# Altium schematic sheet Power_Delivery.SchDoc: FPGA Motherboard for Digital Multiplexed Readout, McGill U.
size Letter; DocumentNumber: DfMUX21; Revision: Rev0, Prototype; SheetNumber: 21; SheetTotal: 27; PageSetup: Record=PageOptions|CenterHorizontal=True|CenterVertical=True|PrintScale=0.93|XCorrection=1.00|YCorrection=1.00|PrintKind=0|BorderSize=5000000|LeftOffset=0|BottomOffset=0|Orientation=2|PaperLength=1000|PaperWidth=1000|Scale=100|PaperSource=7|PrintQuality=-4|MediaType=1|DitherType=10|PaperKind=Letter|PrintScaleMode=1
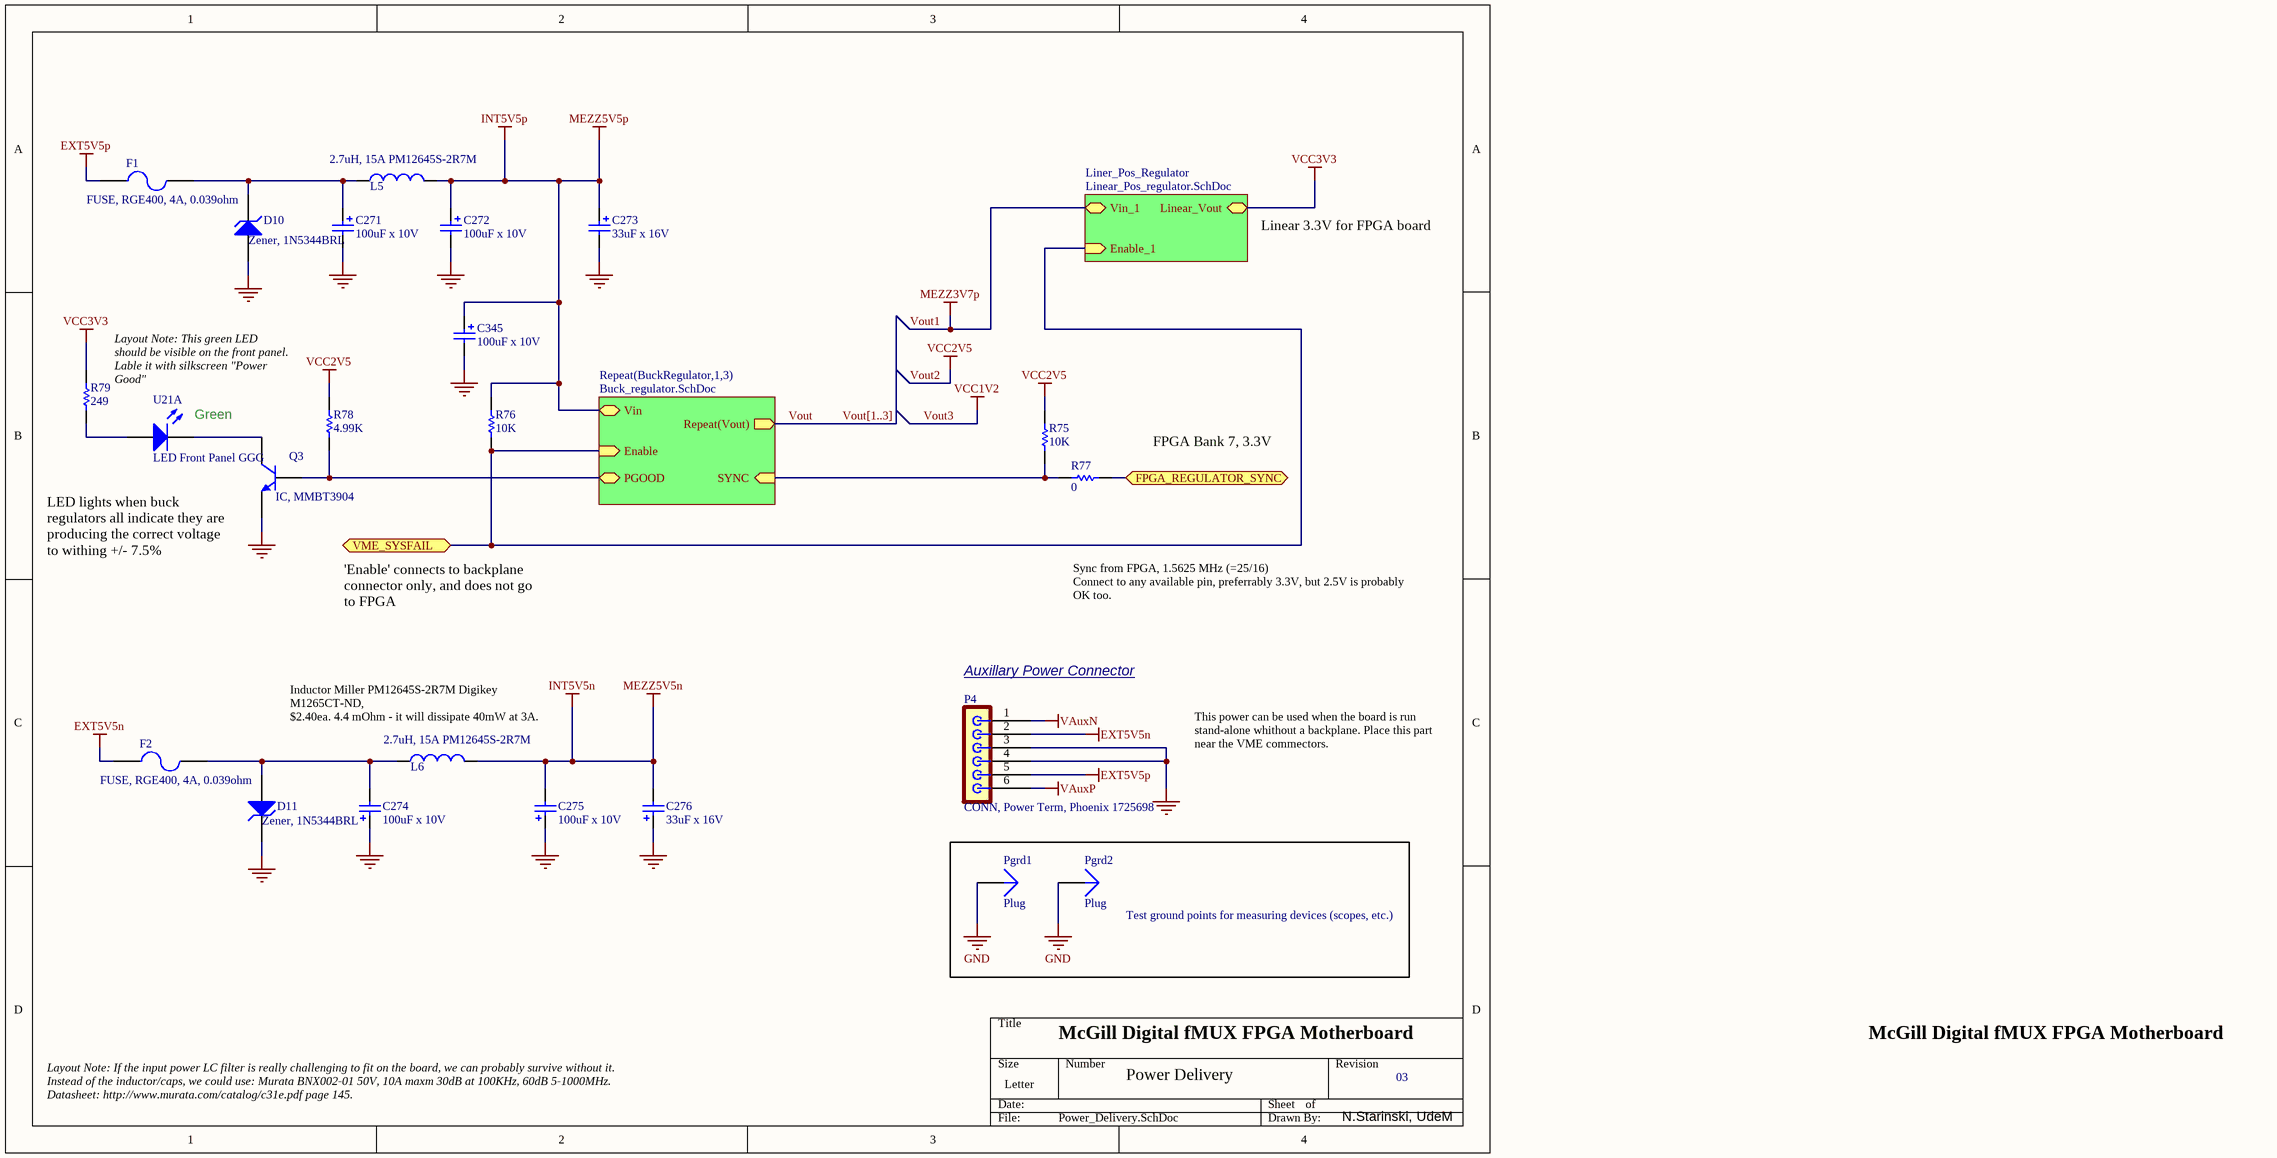
[diagram p0: Power_Delivery.SchDoc]

## Parts
C271  100uF x 10V  [TC6032-2412]
C272  100uF x 10V  [TC6032-2412]
C273  33uF x 16V  [CC4532-1812]
C274  100uF x 10V  [TC6032-2412]
C275  100uF x 10V  [TC6032-2412]
C276  33uF x 16V  [CC4532-1812]
C345  100uF x 10V  [TC6032-2412]
D10  Zener, 1N5344BRL  [DIODE-0.7]
D11  Zener, 1N5344BRL  [DIODE-0.7]
F1  FUSE, RGE400, 4A, 0.039ohm  [Fuse 5.88mm]
F2  FUSE, RGE400, 4A, 0.039ohm  [Fuse 5.88mm]
L5  2.7uH, 15A PM12645S-2R7M  [MLC_inductor]
L6  2.7uH, 15A PM12645S-2R7M  [MLC_inductor]
P4  CONN, Power Term, Phoenix 1725698  [TrmBlk6]
Pgrd1  Plug  [PIN1]
Pgrd2  Plug  [PIN1]
Q3  IC, MMBT3904  [SOT23]
R75  10K  [CR1608-0603]
R76  10K  [CR1608-0603]
R77  0  [CR1608-0603]
R78  4.99K  [CR1608-0603]
R79  249  [CR1608-0603]
U21  LED Front Panel GGG  [LED_Tri_]  (part A of 3)

## Blocks framed on the sheet
Test ground points for measuring devices (scopes, etc.): Pgrd1 Pgrd2

## Sub-sheets
Liner_Pos_Regulator = Linear_Pos_regulator.SchDoc: Vin_1, Enable_1 (in), Linear_Vout
Repeat(BuckRegulator,1,3) = Buck_regulator.SchDoc: Vin, Enable (in), PGOOD (bidir), Repeat(Vout) (out), SYNC (in)

## Ports
FPGA_REGULATOR_SYNC (bidir), VME_SYSFAIL (bidir)

## Nets
EXT5V5n: F2.1 P4.2
EXT5V5p: F1.1 P4.5
GND: C271.2 C272.2 C273.2 C274.1 C275.1 C276.1 C345.2 D10.1(A) D11.2(K) P4.3 P4.4 Pgrd1.1 Pgrd2.1 Q3.2(E)
INT5V5n: C275.2 C276.2 L6.2  [also labelled MEZZ5V5n]
INT5V5p: C272.1 C273.1 C345.1 L5.2 R76.2 ; sheet Repeat(BuckRegulator,1,3)/Vin  [also labelled MEZZ5V5p]
VAuxN: P4.1
VAuxP: P4.6
VCC3V3: R79.2 ; sheet Liner_Pos_Regulator/Linear_Vout
Vout1: sheet Liner_Pos_Regulator/Vin_1  [also labelled MEZZ3V7p]
Vout2: R75.2 R78.2  [also labelled VCC2V5]
FPGA_REGULATOR_SYNC: R77.2 ; port FPGA_REGULATOR_SYNC
VME_SYSFAIL: R76.1 ; port VME_SYSFAIL, sheet Repeat(BuckRegulator,1,3)/Enable, sheet Liner_Pos_Regulator/Enable_1
Vout: sheet Repeat(BuckRegulator,1,3)/Repeat(Vout)
NetC271_1: C271.1 D10.2(K) F1.2 L5.1
NetC274_2: C274.2 D11.1(A) F2.2 L6.1
NetQ3_1: Q3.1(B) R78.1 ; sheet Repeat(BuckRegulator,1,3)/PGOOD
NetQ3_3: Q3.3(C) U21.K1(K)
NetR75_1: R75.1 R77.1 ; sheet Repeat(BuckRegulator,1,3)/SYNC
NetR79_1: R79.1 U21.A1(A)

## Buses and harness runs
bus Vout[1..3]

## Notes on the sheet
- Linear 3.3V for FPGA board
- (near R79) Layout Note: This green LED should be visible on the front panel. Lable it with silkscreen "Power Good"
- (near U21) Green
- FPGA Bank 7, 3.3V
- (near Q3) LED lights when buck regulators all indicate they are producing the correct voltage to withing +/- 7.5%
- 'Enable' connects to backplane connector only, and does not go to FPGA
- Sync from FPGA, 1.5625 MHz (=25/16)
  Connect to any available pin, preferrably 3.3V, but 2.5V is probably OK too.
- (near P4) Auxillary Power Connector
- (near L6) Inductor Miller PM12645S-2R7M Digikey M1265CT-ND,
  $2.40ea. 4.4 mOhm - it will dissipate 40mW at 3A.
- This power can be used when the board is run stand-alone whithout a backplane. Place this part near the VME commectors.
- McGill Digital fMUX FPGA Motherboard
- Layout Note: If the input power LC filter is really challenging to fit on the board, we can probably survive without it.
  Instead of the inductor/caps, we could use: Murata BNX002-01 50V, 10A maxm 30dB at 100KHz, 60dB 5-1000MHz.
  Datasheet: http://www.murata.com/catalog/c31e.pdf page 145.
- Power Delivery
- 03
- N.Starinski, UdeM

## Library data of the parts
C271 C272 C274 C275 C345 = Cap Pol3: CAP TANTC TPSC107K010R0075; Published: 8-Jun-2000; LatestRevisionDate: 17-Jul-2002; LatestRevisionNote: Re-released for DXP Platform.; PackageReference: C0805; Publisher: Altium Limited
C273 C276 = Cap Pol3: CAP POL C4532X5R1C336M; Published: 8-Jun-2000; LatestRevisionDate: 17-Jul-2002; LatestRevisionNote: Re-released for DXP Platform.; PackageReference: C0805; Publisher: Altium Limited
D10 D11 = D Zener: Zener Diode, 8.2V, 5W; Published: 8-Jun-2000; LatestRevisionDate: 17-Jul-2002; LatestRevisionNote: Re-released for DXP Platform.; Publisher: Altium Limited
F1 F2 = Fuse 2: Fuse; Published: 8-Jun-2000; LatestRevisionDate: 17-Jul-2002; LatestRevisionNote: Re-released for DXP Platform.; Publisher: Altium Limited
L5 L6 = Inductor: Code_IEC: 1005; Published: 8-Jun-2000; LatestRevisionDate: 17-Jul-2002; LatestRevisionNote: Re-released for DXP Platform.; PackageReference: 0402-A; Publisher: Altium Limited; Code_JEITA: 0402
P4 = TrmBlk_6pos: MPT 0.5/6-2.54 Terminal Block
Q3 = MMBT3904: NPN Switching Transistor; Published: 17-Sep-2003; DatasheetDocument: 13-May-2002; PackageDocument: May-1999; PackageReference: SOT23; Publisher: Altium Limited; ComponentLink1Description: Manufacturer Link; ComponentLink1URL: http://www.semiconductors.philips.com/; ComponentLink2Description: Datasheet; ComponentLink2URL: http://www.semiconductors.philips.com/acrobat/datasheets/MMBT3904_4.pdf
R75-R79 = Res Semi: Resistor 0603; Published: 8-Jun-2000; LatestRevisionDate: 17-Jul-2002; LatestRevisionNote: Re-released for DXP Platform.; Publisher: Altium Limited
U21 = LED_Tri: 564-0200-222F
Pgrd1 Pgrd2 = Plug: LatestRevisionDate: 17-Jul-2002; LatestRevisionNote: Re-released for DXP Platform.; Publisher: Altium Limited